# Altium schematic sheet Power_Supplies.SchDoc: =ProjectName (part 1 of 2)
size 420 x 297 mm; CompanyName: WUT; Organization: WUT ISE; DocumentNumber: 4; SheetNumber: 12; EDA_Number: ARTIQ; Title2: Power Supplies; ModifiedDate: -
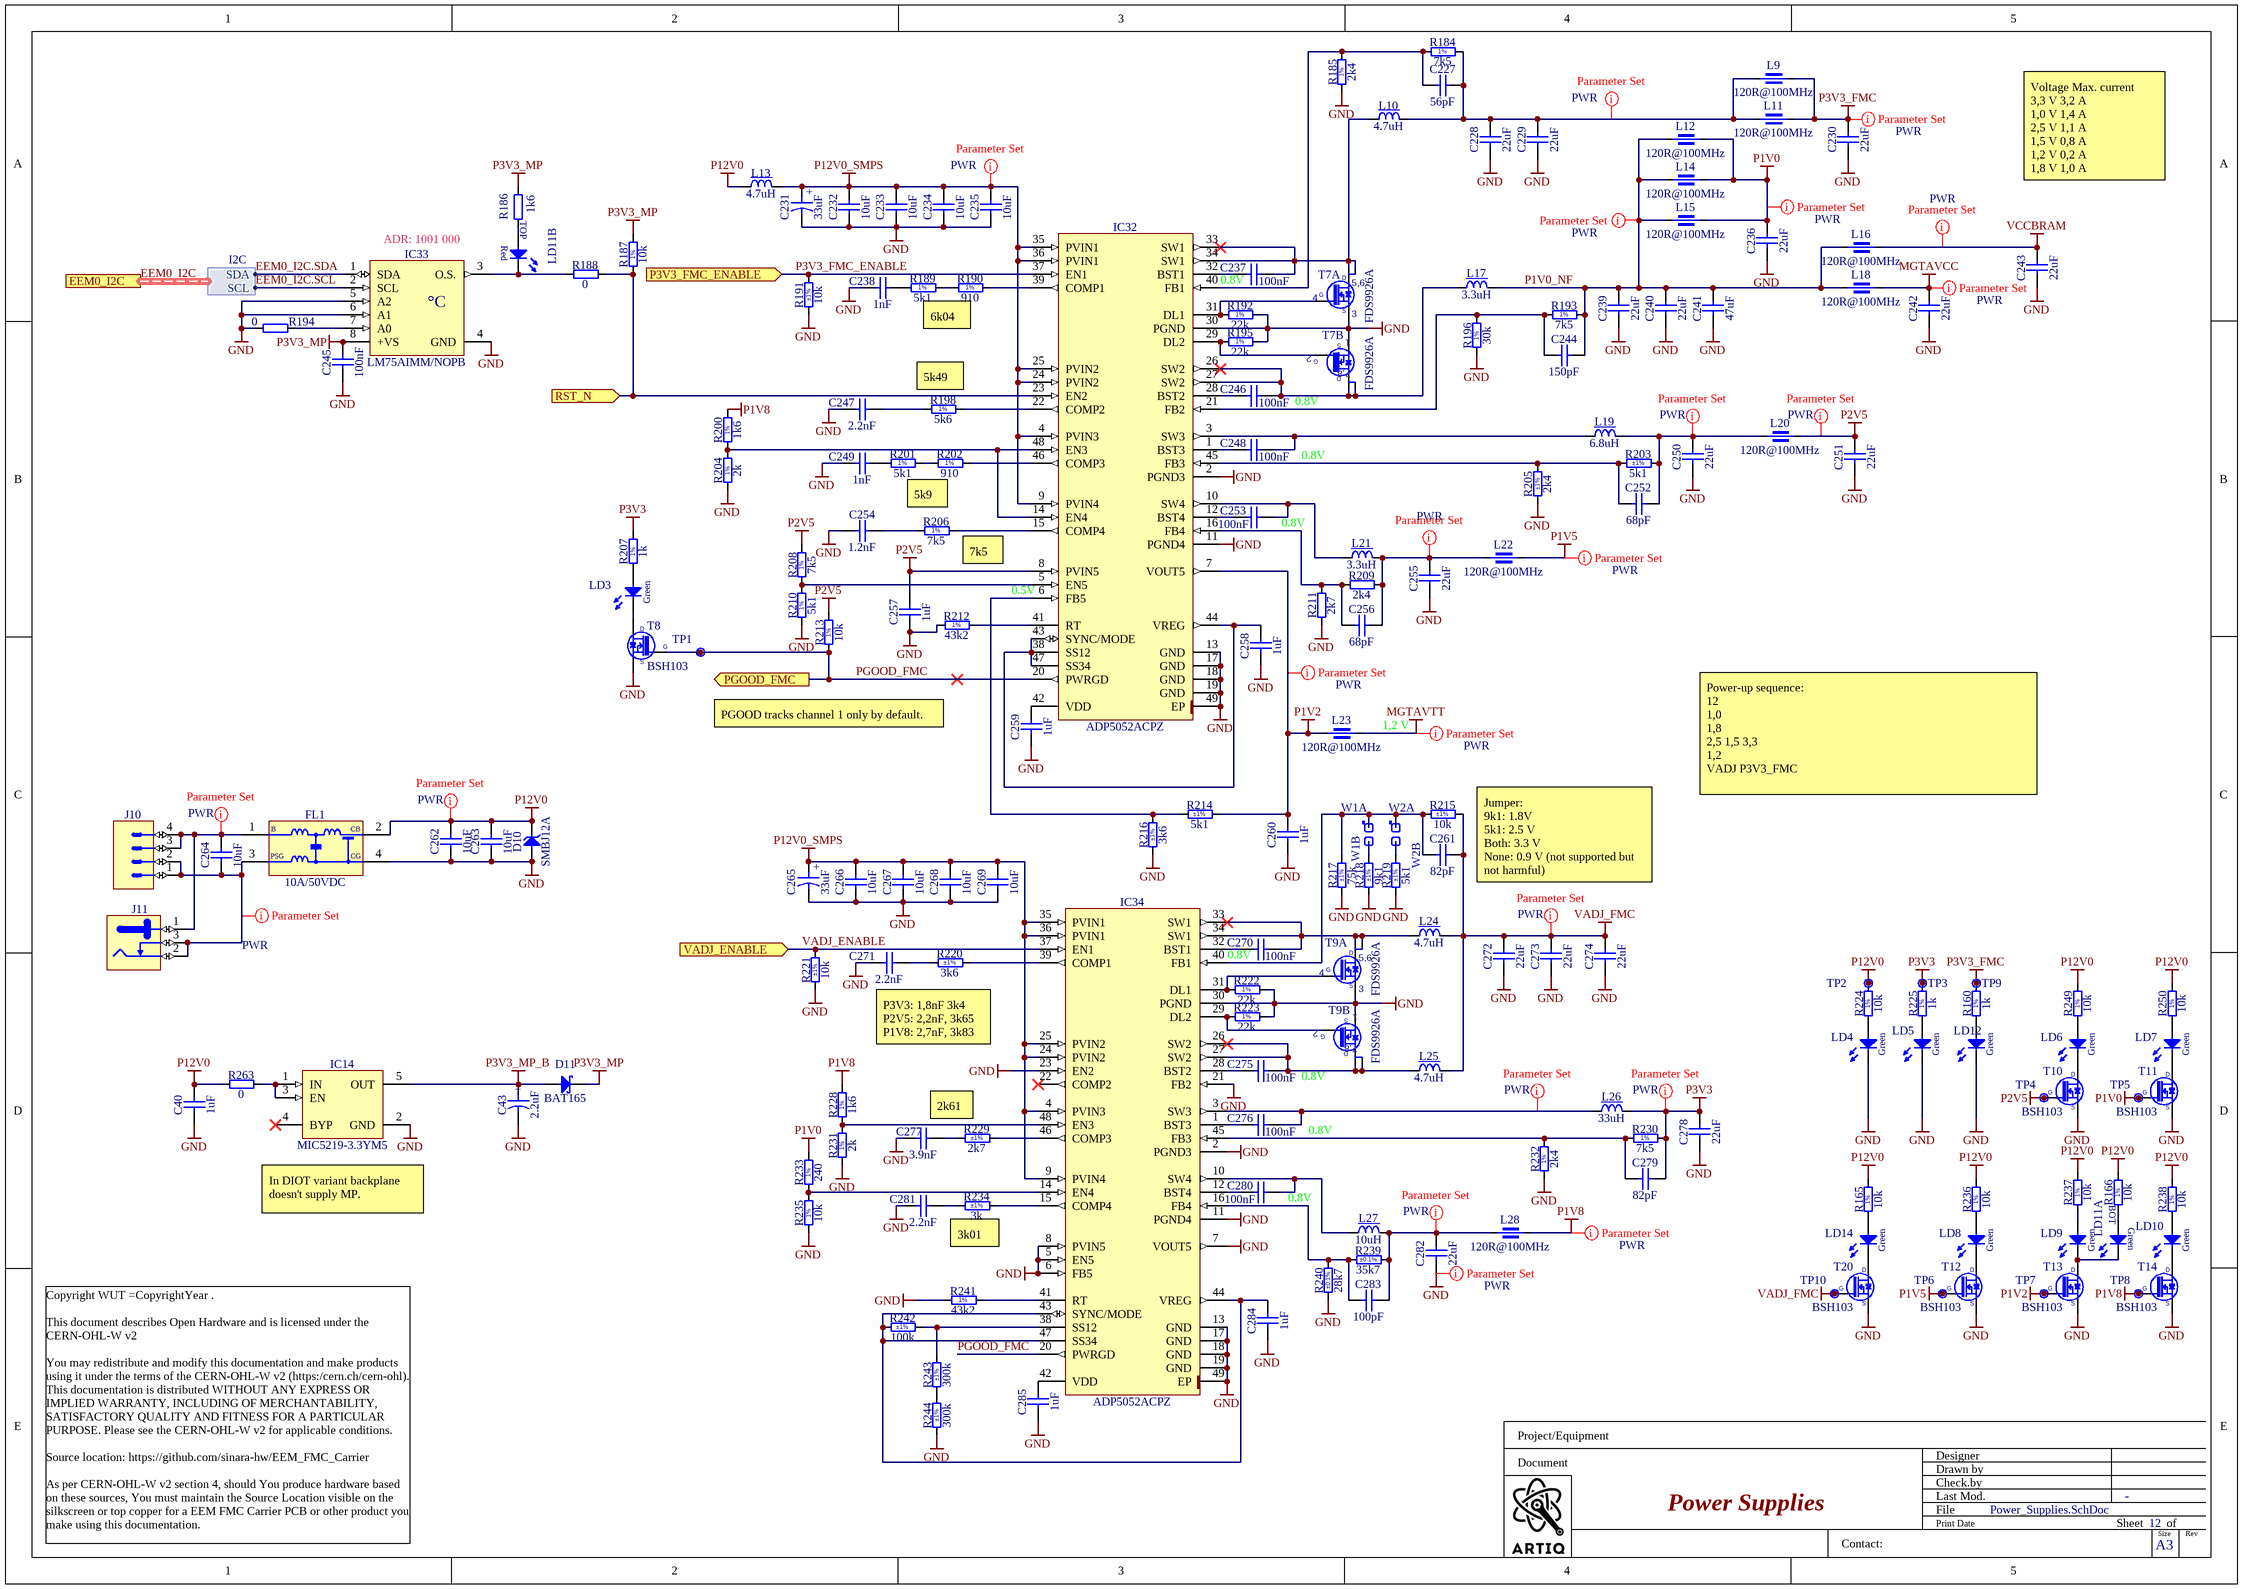
[diagram p0: Power_Supplies.SchDoc]

## Parts
C40  1uF  [CAPC1608X87N]
C43  2.2uF  [CAPMP3216X180N]
C227  56pF  [CAPC1608X87N]
C228  22uF  [CAPC1608X90N]
C229  22uF  [CAPC1608X90N]
C230  22uF  [CAPC1608X90N]
C231  33uF  [CAPMP3528X210N]
C232  10uF  [CAPC2012X95N]
C233  10uF  [CAPC2012X95N]
C234  10uF  [CAPC2012X95N]
C235  10uF  [CAPC2012X95N]
C236  22uF  [CAPC1608X90N]
C237  100nF  [CAPC0603X33N]
C238  1nF  [CAPC1005X55N]
C239  22uF  [CAPC1608X90N]
C240  22uF  [CAPC1608X90N]
C241  47uF  [CAPC1608X100N]
C242  22uF  [CAPC1608X90N]
C243  22uF  [CAPC1608X90N]
C244  150pF  [CAPC1005X55N]
C245  100nF  [CAPC1005X55N]
C246  100nF  [CAPC0603X33N]
C247  2.2nF  [CAPC1005X55N]
C248  100nF  [CAPC0603X33N]
C249  1nF  [CAPC1005X55N]
C250  22uF  [CAPC1608X90N]
C251  22uF  [CAPC1608X90N]
C252  68pF  [CAPC1005X55N]
C253  100nF  [CAPC0603X33N]
C254  1.2nF  [CAPC1608X87N]
C255  22uF  [CAPC1608X90N]
C256  68pF  [CAPC1005X55N]
C257  1uF  [CAPC1005X55N]
C258  1uF  [CAPC1005X55N]
C259  1uF  [CAPC1005X55N]
C260  1uF  [CAPC1005X55N]
C261  82pF  [CAPC1005X55N]
C262  10uF  [CAPC2012X95N]
C263  10uF  [CAPC2012X95N]
C264  10uF  [CAPC2012X95N]
C265  33uF  [CAPMP3528X210N]
C266  10uF  [CAPC2012X95N]
C267  10uF  [CAPC2012X95N]
C268  10uF  [CAPC2012X95N]
C269  10uF  [CAPC2012X95N]
C270  100nF  [CAPC0603X33N]
C271  2.2nF  [CAPC1005X55N]
C272  22uF  [CAPC1608X90N]
C273  22uF  [CAPC1608X90N]
C274  22uF  [CAPC1608X90N]
C275  100nF  [CAPC0603X33N]
C276  100nF  [CAPC0603X33N]
C277  3.9nF  [CAPC1005X55N]
C278  22uF  [CAPC1608X90N]
C279  82pF  [CAPC1005X55N]
C280  100nF  [CAPC0603X33N]
C281  2.2nF  [CAPC1005X55N]
C282  22uF  [CAPC1608X90N]
C283  100pF  [CAPC1005X55N]
C284  1uF  [CAPC1005X55N]
C285  1uF  [CAPC1005X55N]
D10  SMBJ12A  [DIOM5336X265N]
D11  BAT165  [SOD2512X110N]
FL1  10A/50VDC  [FIL_MURATA_BNX02]
IC14  MIC5219-3.3YM5  [SOT95P280X145-5N]
IC32  ADP5052ACPZ  [QFN50P700X700X80-49N-S570]
IC33  LM75AIMM/NOPB  [SOP65P490X109-8N]
IC34  ADP5052ACPZ  [QFN50P700X700X80-49N-S570]
J10  Mini-Fit Jr.™  [MOLEX_39-30-0040]  (value not drawn)
J11  Jack  [SWITCHCRAFT_712RA]  (value not drawn)
L9  120R@100MHz  [INDC1608X65N]
L10  4.7uH  [INDM6965X300N]
L11  120R@100MHz  [INDC1608X65N]
L12  120R@100MHz  [INDC1608X65N]
L13  4.7uH  [INDM6965X300N]
L14  120R@100MHz  [INDC1608X65N]
L15  120R@100MHz  [INDC1608X65N]
L16  120R@100MHz  [INDC1608X65N]
L17  3.3uH  [INDM5552X200N]
L18  120R@100MHz  [INDC1608X65N]
L19  6.8uH  [IND_COILCRAFT_XAL4030]
L20  120R@100MHz  [INDC1608X65N]
L21  3.3uH  [INDM5552X200N]
L22  120R@100MHz  [INDC1608X65N]
L23  120R@100MHz  [INDC1608X65N]
L24  4.7uH  [INDM6965X300N]
L25  4.7uH  [INDM6965X300N]
L26  33uH  [IND_WURTH_WE-TPC_4828]
L27  10uH  [IND_TDK_VLCF5020-1]
L28  120R@100MHz  [INDC1608X65N]
LD3  Green  [LED_KINGBRIGHT_KPH-1608CGCK]
LD4  Green  [LED_KINGBRIGHT_KPH-1608CGCK]
LD5  Green  [LED_KINGBRIGHT_KPH-1608CGCK]
LD6  Green  [LED_KINGBRIGHT_KPH-1608CGCK]
LD7  Green  [LED_KINGBRIGHT_KPH-1608CGCK]
LD8  Green  [LED_KINGBRIGHT_KPH-1608CGCK]
LD9  Green  [LED_KINGBRIGHT_KPH-1608CGCK]
LD10  Green  [LED_KINGBRIGHT_KPH-1608CGCK]
LD11  Red/Green  [LED_DIALIGHT_571-0112F]  (value not drawn)  (parts A,B of 2)
LD12  Green  [LED_KINGBRIGHT_KPH-1608CGCK]
LD14  Green  [LED_KINGBRIGHT_KPH-1608CGCK]
R160  1k  [RESC1005X40N]
R165  10k  [RESC1005X40N]
R166  10k  [RESC1005X40N]
R184  7k5  [RESC1005X40N]
R185  2k4  [RESC1005X40N]
R186  1k6  [RESC1005X40N]
R187  10k  [RESC1005X40N]
R188  0  [RESC1005X40N]
R189  5k1  [RESC1005X40N]
R190  910  [RESC1005X40N]
R191  10k  Tolerance: ±1%  [RESC1005X40N]
R192  22k  [RESC1005X40N]
R193  7k5  [RESC1005X40N]
R194  0  [RESC1005X40N]
R195  22k  [RESC1005X40N]
R196  30k  [RESC1005X40N]
R198  5k6  [RESC1005X40N]
R200  1k6  [RESC1005X40N]
R201  5k1  [RESC1005X40N]
R202  910  [RESC1005X40N]
R203  5k1  Tolerance: ±1%  [RESC1005X40N]
R204  2k  [RESC1005X40N]
R205  2k4  Tolerance: ±1%  [RESC1005X40N]
R206  7k5  [RESC1005X40N]
R207  1k  [RESC1005X40N]
R208  7k5  [RESC1005X40N]
R209  2k4  [RESC1005X40N]
R210  5k1  [RESC1005X40N]
R211  2k7  [RESC1608X55N]
R212  43k2  [RESC1005X35N]
R213  10k  [RESC1005X40N]
R214  5k1  Tolerance: ±1%  [RESC1005X40N]
R215  10k  Tolerance: ±1%  [RESC1005X40N]
R216  3k6  Tolerance: ±1%  [RESC1005X40N]
R217  75k  Tolerance: ±1%  [RESC1005X40N]
R218  9k1  Tolerance: ±1%  [RESC1005X40N]
R219  5k1  Tolerance: ±1%  [RESC1005X40N]
R220  3k6  Tolerance: ±1%  [RESC1005X40N]
R221  10k  Tolerance: ±1%  [RESC1005X40N]
R222  22k  [RESC1005X40N]
R223  22k  [RESC1005X40N]
R224  10k  [RESC1005X40N]
R225  1k  [RESC1005X40N]
R228  1k6  [RESC1005X40N]
R229  2k7  Tolerance: ±1%  [RESC1608X55N]
R230  7k5  [RESC1005X40N]
R231  2k  [RESC1005X40N]
R232  2k4  [RESC1005X40N]
R233  240  [RESC1005X40N]
R234  3k  Tolerance: ±1%  [RESC1005X40N]
R235  10k  [RESC1005X40N]
R236  10k  [RESC1005X40N]
R237  10k  [RESC1005X40N]
R238  10k  [RESC1005X40N]
R239  35k7  Tolerance: ±0.1%  [RESC1608X55N]
R240  28k7  Tolerance: ±0.1%  [RESC1608X55N]
R241  43k2  [RESC1005X35N]
R242  100k  Tolerance: ±1%  [RESC1005X40N]
R243  300k  Tolerance: ±1%  [RESC1005X40N]
R244  300k  Tolerance: ±1%  [RESC1005X40N]
R249  10k  [RESC1005X40N]
R250  10k  [RESC1005X40N]
R263  0  [RESC1005X40N]
T7  FDS9926A  [SOIC127P600X175-8N]  (parts A,B of 2)
T8  BSH103  [SOT95P230X110-3N]
T9  FDS9926A  [SOIC127P600X175-8N]  (parts A,B of 2)
T10  BSH103  [SOT95P230X110-3N]
T11  BSH103  [SOT95P230X110-3N]
T12  BSH103  [SOT95P230X110-3N]
T13  BSH103  [SOT95P230X110-3N]
T14  BSH103  [SOT95P230X110-3N]
T20  BSH103  [SOT95P230X110-3N]
TP1  Power Good  [TPS127]  (value not drawn)  (no BOM)
TP2  P12V0  [TPS127]  (value not drawn)  (no BOM)
TP3  P3V3  [TPS127]  (value not drawn)  (no BOM)
TP4  P2V5  [TPS127]  (value not drawn)  (no BOM)
TP5  P1V0  [TPS127]  (value not drawn)  (no BOM)
TP6  P1V5  [TPS127]  (value not drawn)  (no BOM)
TP7  P1V2  [TPS127]  (value not drawn)  (no BOM)
TP8  P1V8  [TPS127]  (value not drawn)  (no BOM)
TP9  P3V3  [TPS127]  (value not drawn)  (no BOM)
TP10  P1V8  [TPS127]  (value not drawn)  (no BOM)
W1  Header 2  [SAMTEC_MTLW-102-07-L-S-250]  (value not drawn)  (parts A,B of 2)
W2  Header 2  [SAMTEC_MTLW-102-07-L-S-250]  (value not drawn)  (parts A,B of 2)

## Ports
EEM0_I2C (harness I2C), P3V3_FMC_ENABLE (in), PGOOD_FMC (out), RST_N (in), VADJ_ENABLE (in)

## Harnesses
I2C: SDA, SCL

## Nets
GND: C40.1 C43.2 C228.1 C229.1 C230.1 C231.2 C232.1 C233.1 C234.1 C235.1 C236.1 C238.1 C239.1 C240.1 C241.1 C242.1 C243.1 C245.1 C247.1 C249.1 C250.1 C251.1 C254.1 C255.1 C257.1 C258.1 C259.1 C260.1 C262.1 C263.1 C265.2 C266.1 C267.1 C268.1 C269.1 C271.1 C272.1 C273.1 C274.1 C277.1 C278.1 C281.1 C282.1 C284.1 C285.1 D10.2(A) FL1.4(CG) IC14.2(GND) IC32.2(PGND3) IC32.11(PGND4) IC32.13(GND) IC32.17(GND) IC32.18(GND) IC32.19(GND) IC32.30(PGND) IC32.49(EP) IC33.4(GND) IC33.5(A2) IC33.6(A1) IC34.2(PGND3) IC34.5(EN5) IC34.6(FB5) IC34.7(VOUT5) IC34.8(PVIN5) IC34.11(PGND4) IC34.13(GND) IC34.17(GND) IC34.18(GND) IC34.19(GND) IC34.21(FB2) IC34.23(EN2) IC34.30(PGND) IC34.49(EP) LD4.1(C) LD5.1(C) LD12.1(C) R185.1 R191.1 R192.2 R194.1 R195.2 R196.1 R204.1 R205.1 R210.1 R211.1 R212.1 R216.1 R217.1 R218.1 R219.1 R221.1 R222.2 R223.2 R231.1 R232.1 R235.1 R240.1 R241.1 R244.1 T7.1(S) T7.3(S) T8.2(S) T9.1(S) T9.3(S) T10.2(S) T11.2(S) T12.2(S) T13.2(S) T14.2(S) T20.2(S)
MGTAVCC: C242.2 L18.2
MGTAVTT: L23.2
P1V0: C236.2 L12.2 L14.2 L15.2 R233.2 T11.1(G) TP5.1
P1V2: C260.2 IC32.7(VOUT5) L23.1 R214.2 T13.1(G) TP7.1
P1V5: L22.2 T12.1(G) TP6.1
P1V8: L28.2 R200.2 R228.2 T14.1(G) TP8.1
P2V5: C251.2 C257.2 IC32.8(PVIN5) L20.2 R208.2 R213.2 T10.1(G) TP4.1
P3V3: C278.2 C279.2 L26.2 R207.2 R225.2 R230.2 TP3.1
P3V3_FMC: C230.2 L9.2 L11.2 R160.2 TP9.1
P3V3_MP: C245.2 D11.1(C) IC33.8(+VS) R186.2 R187.2
P3V3_MP_B: C43.1 D11.2(A) IC14.5(OUT)
P12V0: C40.2 C262.2 C263.2 D10.1(C) FL1.2(CB) L13.1 R165.2 R166.2 R224.2 R236.2 R237.2 R238.2 R249.2 R250.2 R263.1 TP2.1
P12V0_SMPS: C231.1 C232.2 C233.2 C234.2 C235.2 C265.1 C266.2 C267.2 C268.2 C269.2 IC32.4(PVIN3) IC32.9(PVIN4) IC32.24(PVIN2) IC32.25(PVIN2) IC32.35(PVIN1) IC32.36(PVIN1) IC34.4(PVIN3) IC34.9(PVIN4) IC34.24(PVIN2) IC34.25(PVIN2) IC34.35(PVIN1) IC34.36(PVIN1) L13.2
VADJ_FMC: C261.2 C272.2 C273.2 C274.2 L24.2 L25.2 R215.2 T20.1(G) TP10.1
VCCBRAM: C243.2 L16.2
EEM0_I2C.SCL: IC33.2(SCL) ; port EEM0_I2C.SCL
EEM0_I2C.SDA: IC33.1(SDA) ; port EEM0_I2C.SDA
P1V0_NF: C239.2 C240.2 C241.2 C244.2 L12.1 L14.1 L15.1 L16.1 L17.2 L18.1 R193.2
P3V3_FMC_ENABLE: IC32.37(EN1) R191.2 ; port P3V3_FMC_ENABLE
PGOOD_FMC: IC32.20(PWRGD) IC34.20(PWRGD) R213.1 T8.1(G) TP1.1 ; port PGOOD_FMC
RST_N: IC32.23(EN2) R187.1 R188.2 ; port RST_N
VADJ_ENABLE: IC34.37(EN1) R221.2 ; port VADJ_ENABLE
NetC227_1: C227.1 IC32.40(FB1) R184.1 R185.2
NetC227_2: C227.2 C228.2 C229.2 L9.1 L10.2 L11.1 R184.2
NetC237_1: C237.1 IC32.33(SW1) IC32.34(SW1) L10.1 T7.5(D) T7.6(D)
NetC237_2: C237.2 IC32.32(BST1)
NetC238_2: C238.2 R189.1
NetC244_1: C244.1 IC32.21(FB2) R193.1 R196.2
NetC246_1: C246.1 IC32.26(SW2) IC32.27(SW2) L17.1 T7.7(D) T7.8(D)
NetC246_2: C246.2 IC32.28(BST2)
NetC247_2: C247.2 R198.1
NetC248_1: C248.1 IC32.3(SW3) L19.1
NetC248_2: C248.2 IC32.1(BST3)
NetC249_2: C249.2 R201.1
NetC250_2: C250.2 C252.2 L19.2 L20.1 R203.2
NetC252_1: C252.1 IC32.45(FB3) R203.1 R205.2
NetC253_1: C253.1 IC32.10(SW4) L21.1
NetC253_2: C253.2 IC32.12(BST4)
NetC254_2: C254.2 R206.1
NetC255_2: C255.2 C256.2 L21.2 L22.1 R209.2
NetC256_1: C256.1 IC32.16(FB4) R209.1 R211.2
NetC258_2: C258.2 IC32.38(SS12) IC32.43(SYNC/MODE) IC32.44(VREG) IC32.47(SS34)
NetC259_2: C259.2 IC32.42(VDD)
NetC261_1: C261.1 IC34.40(FB1) R215.1 R217.2 W1.1 W2.1
NetC264_1: C264.1 FL1.3(PSG) J10.1 J10.2 J11.2 J11.3
NetC264_2: C264.2 FL1.1(B) J10.3 J10.4 J11.1
NetC270_1: C270.1 IC34.33(SW1) IC34.34(SW1) L24.1 T9.5(D) T9.6(D)
NetC270_2: C270.2 IC34.32(BST1)
NetC271_2: C271.2 R220.1
NetC275_1: C275.1 IC34.26(SW2) IC34.27(SW2) L25.1 T9.7(D) T9.8(D)
NetC275_2: C275.2 IC34.28(BST2)
NetC276_1: C276.1 IC34.3(SW3) L26.1
NetC276_2: C276.2 IC34.1(BST3)
NetC277_2: C277.2 R229.1
NetC279_1: C279.1 IC34.45(FB3) R230.1 R232.2
NetC280_1: C280.1 IC34.10(SW4) L27.1
NetC280_2: C280.2 IC34.12(BST4)
NetC281_2: C281.2 R234.1
NetC282_2: C282.2 C283.2 L27.2 L28.1 R239.2
NetC283_1: C283.1 IC34.16(FB4) R239.1 R240.2
NetC284_2: C284.2 IC34.43(SYNC/MODE) IC34.44(VREG) IC34.47(SS34) R242.1
NetC285_2: C285.2 IC34.42(VDD)
NetIC14_1: IC14.1(IN) IC14.3(EN) R263.2
NetIC32_5: IC32.5(EN5) R208.1 R210.2
NetIC32_6: IC32.6(FB5) R214.1 R216.2
NetIC32_14: IC32.14(EN4) IC32.48(EN3) R200.1 R204.2
NetIC32_15: IC32.15(COMP4) R206.2
NetIC32_22: IC32.22(COMP2) R198.2
NetIC32_29: IC32.29(DL2) R195.1 T7.2(G)
NetIC32_31: IC32.31(DL1) R192.1 T7.4(G)
NetIC32_39: IC32.39(COMP1) R190.2
NetIC32_41: IC32.41(RT) R212.2
NetIC32_46: IC32.46(COMP3) R202.2
NetIC33_3: IC33.3(O.S.) LD11.3(C) R188.1
NetIC33_7: IC33.7(A0) R194.2
NetIC34_14: IC34.14(EN4) R233.1 R235.2
NetIC34_15: IC34.15(COMP4) R234.2
NetIC34_29: IC34.29(DL2) R223.1 T9.2(G)
NetIC34_31: IC34.31(DL1) R222.1 T9.4(G)
NetIC34_38: IC34.38(SS12) R242.2 R243.2
NetIC34_39: IC34.39(COMP1) R220.2
NetIC34_41: IC34.41(RT) R241.2
NetIC34_46: IC34.46(COMP3) R229.2
NetIC34_48: IC34.48(EN3) R228.1 R231.2
NetLD3_1: LD3.1(C) T8.3(D)
NetLD3_2: LD3.2(A) R207.1
NetLD4_2: LD4.2(A) R224.1
NetLD5_2: LD5.2(A) R225.1
NetLD6_1: LD6.1(C) T10.3(D)
NetLD6_2: LD6.2(A) R249.1
NetLD7_1: LD7.1(C) T11.3(D)
NetLD7_2: LD7.2(A) R250.1
NetLD8_1: LD8.1(C) T12.3(D)
NetLD8_2: LD8.2(A) R236.1
NetLD9_1: LD9.1(C) LD11.1(C) T13.3(D)
NetLD9_2: LD9.2(A) R237.1
NetLD10_1: LD10.1(C) T14.3(D)
NetLD10_2: LD10.2(A) R238.1
NetLD11_2: LD11.2(A) R166.1
NetLD11_4: LD11.4(A) R186.1
NetLD12_2: LD12.2(A) R160.1
NetLD14_1: LD14.1(C) T20.3(D)
NetLD14_2: LD14.2(A) R165.1
NetR189_2: R189.2 R190.1
NetR201_2: R201.2 R202.1
NetR218_2: R218.2 W1.2
NetR219_2: R219.2 W2.2
NetR243_1: R243.1 R244.2

Not connected (* = marked no-connect by the designer): IC14 4(BYP)*; IC34 22(COMP2)*

## Buses and harness runs
harness EEM0_I2C = port EEM0_I2C

## Layout directives
net class PWR: GND, MGTAVCC, MGTAVTT, NetC227_2, NetC250_2, NetC255_2, NetC264_1, NetC264_2, NetC276_1, NetC282_2, P1V0, P1V0_NF, P1V2, P1V5, P1V8, P2V5, P3V3, P3V3_FMC, P12V0, P12V0_SMPS, VADJ_FMC, VCCBRAM

## Notes on the sheet
- Voltage	Max. current
  3,3 V	3,2 A
  1,0 V	1,4 A
  2,5 V	1,1 A
  1,5 V	0,8 A
  1,2 V	0,2 A
  1,8 V	1,0 A
- (near IC33) ADR: 1001 000
- 6k04
- (near C237) 0.8V
- (near R198) 5k49
- (near T7) 0.8V
- (near C248) 0.8V
- 5k9
- (near C253) 0.8V
- (near R206) 7k5
- (near IC32) 0.5V
- PGOOD tracks channel 1 only by default.
- (near L23) 1,2 V
- Power-up sequence:
  12
  1,0
  1,8
  2,5 1,5 3,3
  1,2
  VADJ P3V3_FMC
- Jumper:
  9k1: 1.8V
  5k1: 2.5 V
  Both: 3.3 V
  None: 0.9 V (not supported but not harmful)
- (near C270) 0.8V
- P3V3: 1,8nF 3k4
  P2V5: 2,2nF, 3k65
  P1V8: 2,7nF, 3k83
- 2k61
- (near T9) 0.8V
- (near C276) 0.8V
- (near IC14) In DIOT variant backplane doesn't supply MP.
- (near C280) 0.8V
- (near R234) 3k01
- Project/Equipment
- Document
- Designer
- Drawn by
- Check.by
- Copyright WUT =CopyrightYear .
  This document describes Open Hardware and is licensed under the CERN-OHL-W v2
  You may redistribute and modify this documentation and make products using it under the terms of the CERN-OHL-W v2 (https:/cern.ch/cern-ohl). This documentation is distributed WITHOUT ANY EXPRESS OR IMPLIED WARRANTY, INCLUDING OF MERCHANTABILITY, SATISFACTORY QUALITY AND FITNESS FOR A PARTICULAR PURPOSE. Please see the CERN-OHL-W v2 for applicable conditions.
  Source location: https://github.com/sinara-hw/EEM_FMC_Carrier
  As per CERN-OHL-W v2 section 4, should You produce hardware based on these sources, You must maintain the Source Location visible on the silkscreen or top copper for a EEM FMC Carrier PCB or other product you make using this documentation.
- Contact:
- File
- Last Mod.
- Print Date
- Sheet
- Size
- A3
- of
- Rev
- (in symbol 43k2 1% 0402) 1%
- (in symbol CTE3216-18_2.2UF_25V_10%) +
- (in symbol CTE3528-21_33UF_16V_10%) +
- (in symbol FDS9926A, part A) 5,6
- (in symbol FDS9926A, part B) 7,8
- (in symbol LED_DIALIGHT_571-0112F, part A) BOT; Green
- (in symbol LED_DIALIGHT_571-0112F, part B) TOP; Red
- (in symbol LM75AIMM/NOPB) °C
- (in symbol R0402_1K6_1%_0.0625W_100PPM) 1%
- (in symbol R0402_1K_1%_0.0625W_100PPM) 1%
- (in symbol R0402_2K4_1%_0.0625W_100PPM) 1%
- (in symbol R0402_2K_1%_0.0625W_100PPM) 1%
- (in symbol R0402_5K1_1%_0.0625W_100PPM) 1%
- (in symbol R0402_5K6_1%_0.0625W_100PPM) 1%
- (in symbol R0402_7K5_1%_0.0625W_100PPM) 1%
- (in symbol R0402_10K_1%_0.0625W_100PPM) 1%
- (in symbol R0402_22K_1%_0.0625W_100PPM) 1%
- (in symbol R0402_30K_1%_0.0625W_100PPM) 1%
- (in symbol R0402_240R_1%_0.0625W_100PPM) 1%
- (in symbol R0402_910R_1%_0.0625W_100PPM) 1%